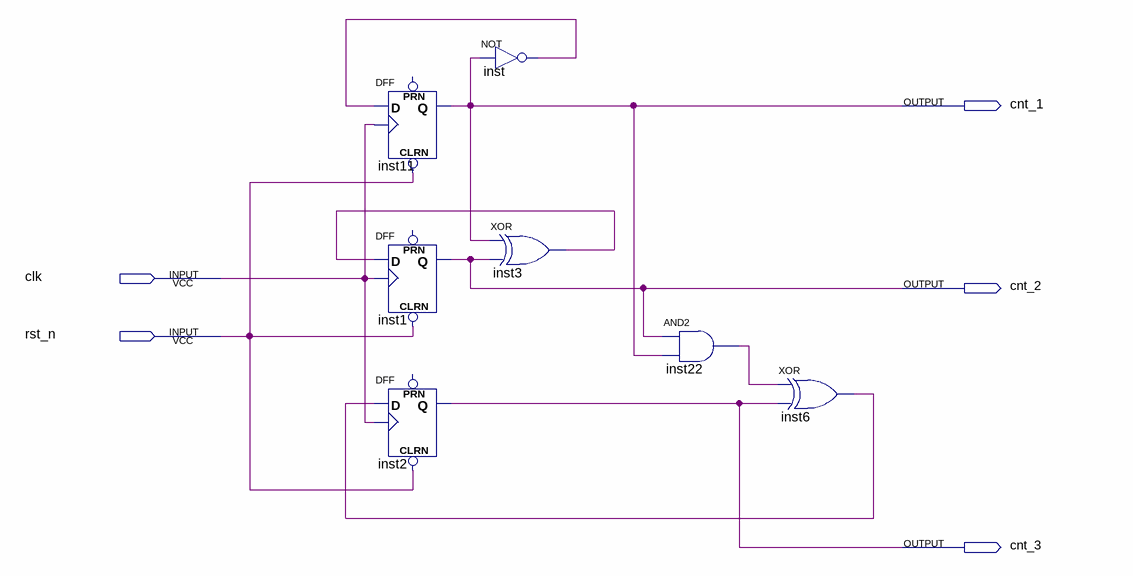
[diagram p0: schematic sheet]
// Quartus schematic counter8.bdf as structural Verilog: 7 symbols, 5 pins
module counter8 (
  input  clk,
  input  rst_n,
  output cnt_1,
  output cnt_2,
  output cnt_3
);

  wire inst3_out, inst6_out, inst22_out, inst_out;

  DFF inst11 (.CLRN(rst_n), .CLK(clk), .D(inst_out), .Q(cnt_1));  // open: PRN
  DFF inst1 (.CLRN(rst_n), .CLK(clk), .D(inst3_out), .Q(cnt_2));  // open: PRN
  DFF inst2 (.CLRN(rst_n), .CLK(clk), .D(inst6_out), .Q(cnt_3));  // open: PRN
  not inst (inst_out, cnt_1);
  xor inst3 (inst3_out, cnt_1, cnt_2);
  and inst22 (inst22_out, cnt_2, cnt_1);
  xor inst6 (inst6_out, inst22_out, cnt_3);
endmodule
